# EAGLE design mosfet (EAGLE 8.5.1)
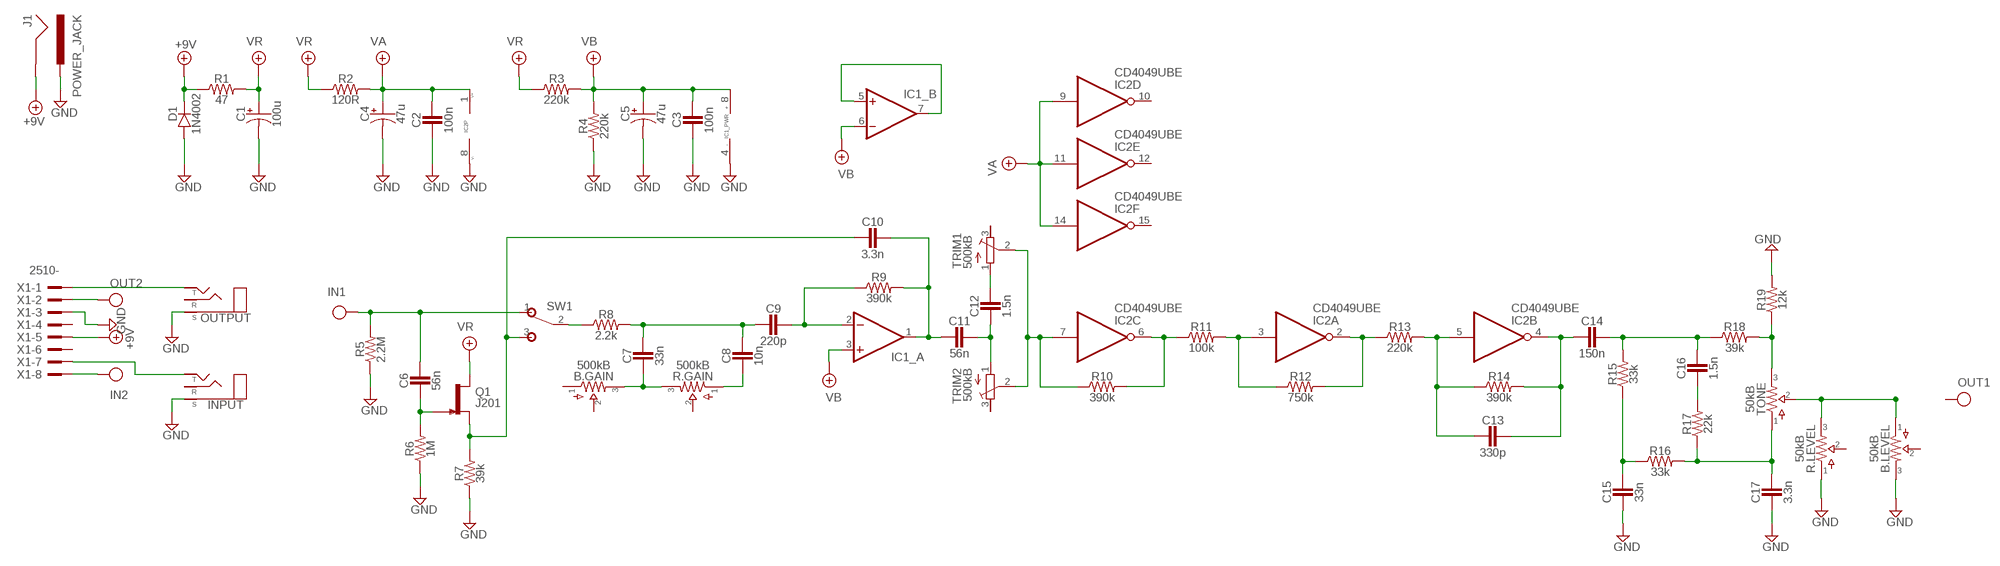
[diagram p0: schematic, sheet 1]

## Parts
B.GAIN  500kB  POTS16MM  [16MM]
B.LEVEL  50kB  POTS16MM  [16MM]
C1  100u  0500  [050_020]
C2  100n  CER/FILM2  [050X030_025_2]
C3  100n  CER/FILM2  [050X030_025_2]
C4  47u  0500  [050_020]
C5  47u  0500  [050_020]
C6  56n  CER/FILMBOX.1  [BOX_SMALL]
C7  33n  CER/FILMBOX.1  [BOX_SMALL]
C8  10n  CER/FILMBOX.1  [BOX_SMALL]
C9  220p  CER/FILM2  [050X030_025_2]
C10  3.3n  CER/FILM2  [050X030_025_2]
C11  56n  CER/FILM2  [050X030_025_2]
C12  1.5n  CER/FILM2  [050X030_025_2]
C13  330p  CER/FILM2  [050X030_025_2]
C14  150n  CER/FILM2  [050X030_025_2]
C15  33n  CER/FILM2  [050X030_025_2]
C16  1.5n  CER/FILM2  [050X030_025_2]
C17  3.3n  CER/FILM2  [050X030_025_2]
D1  1N4002  DO41.2  [DO41-2]
IC1  DUALTH  [DIL0]
IC2  CD4049UBE  [DIL16]
INPUT  STEREONMJ  [NMJ6HCD2]
J1  POWER_JACK  [POWER_JACK_PTH]
OUTPUT  STEREONMJ  [NMJ6HCD2]
Q1  J201  [TO92-]
R1  47  R_.3B  [R0207/3]
R2  120R  R_.3B  [R0207/3]
R3  220k  R_.3B  [R0207/3]
R4  220k  R_.3B  [R0207/3]
R5  2.2M  R_.3B  [R0207/3]
R6  1M  R_.3B  [R0207/3]
R7  39k  R_.3B  [R0207/3]
R8  2.2k  R_.3B  [R0207/3]
R9  390k  R_.3B  [R0207/3]
R10  390k  R_.3B  [R0207/3]
R11  100k  R_.3B  [R0207/3]
R12  750k  R_.3B  [R0207/3]
R13  220k  R_.3B  [R0207/3]
R14  390k  R_.3B  [R0207/3]
R15  33k  R_.3B  [R0207/3]
R16  33k  R_.3B  [R0207/3]
R17  22k  R_.3B  [R0207/3]
R18  39k  R_.3B  [R0207/3]
R19  12k  R_.3B  [R0207/3]
R.GAIN  500kB  POTS16MM  [16MM]
R.LEVEL  50kB  POTS16MM  [16MM]
SW1  SPDT  [M9040P]
TONE  50kB  POTS16MM  [16MM]
TRIM1  500kB  R-TRIMM3296W  [RTRIM3296W]
TRIM2  500kB  R-TRIMM3296W  [RTRIM3296W]
X1  2510-  [PAK100/2500-10]

## Nets
+9V: D1.C J1.GND R1.1 X1.5
GND: B.LEVEL.3 C1.- C2.1 C3.1 C4.- C5.- C15.1 C17.1 D1.A IC1.4(_PWR:V-) IC2.8(P:VSS) INPUT.S J1.PWR OUTPUT.S R4.1 R5.1 R6.1 R7.1 R19.2 R.LEVEL.1 X1.3
IN: C6.2 R5.2 SW1.1(O) X1.8
N$1: INPUT.T X1.7
N$2: C6.1 Q1.1(G) R6.2
N$3: C10.1 Q1.2(S) R7.2 SW1.3(S)
N$4: OUTPUT.T X1.1
N$5: R8.1 SW1.2(P)
N$6: C7.2 C8.2 C9.1 R8.2
N$7: B.GAIN.3 C7.1 R.GAIN.3
N$8: C8.1 R.GAIN.1
N$9: C9.2 IC1.2(_A:-IN) R9.1
N$10: C10.2 C11.1 IC1.1(_A:OUT) R9.2
N$11: C11.2 C12.1 TRIM2.1(A)
N$12: C12.2 TRIM1.1(A)
N$13: IC2.7(C:I) R10.1 TRIM1.2(S) TRIM2.2(S)
N$14: IC2.6(C:O) R10.2 R11.1
N$15: IC2.3(A:I) R11.2 R12.1
N$16: IC2.2(A:O) R12.2 R13.1
N$17: C13.1 IC2.5(B:I) R13.2 R14.1
N$18: C13.2 C14.1 IC2.4(B:O) R14.2
N$20: C14.2 C16.2 R15.2 R18.1
N$21: R18.2 R19.1 TONE.3
N$22: C16.1 R17.2
N$23: C17.2 R16.2 R17.1 TONE.1
N$24: C15.2 R15.1 R16.1
N$25: B.LEVEL.1 R.LEVEL.3 TONE.2
N$26: IC1.5(_B:+IN) IC1.7(_B:OUT)
OUT: X1.2
VA: C2.2 C4.+ IC2.1(P:VDD) IC2.9(D:I) IC2.11(E:I) IC2.14(F:I) R2.2
VB: C3.2 C5.+ IC1.3(_A:+IN) IC1.6(_B:-IN) IC1.8(_PWR:V+) R3.2 R4.2
VR: C1.+ Q1.3(D) R1.2 R2.1 R3.1
Unconnected: B.GAIN.1 B.GAIN.2 B.LEVEL.2 IC2.10(D:O) IC2.12(E:O) IC2.15(F:O) INPUT.R OUTPUT.R R.GAIN.2 R.LEVEL.2 TRIM1.3(E) TRIM2.3(E) X1.4 X1.6

## Library data of the parts
B.GAIN B.LEVEL R.GAIN R.LEVEL TONE = pedals-potentiometers:POTS
C1 C4 C5 = pedals-capacitors-elec:050
C2 C3 C6-C17 = pedals-capacitors-film:CER/FILM: 47 - 120pF Xicon Ceramic Disc 2.5mm lead spacing
D1 = pedals-diodes:DO41: DO-41 Package Diodes: 1N4001 - 1N40019 Zener Diodes: 1N4728 - 1N4764
IC1 = pedals-integrated circuits:DUAL: OP AMP
IC2 = pedals-integrated circuits:CD4049UBE: Hex Inverting Buffer Used, for example, in the Red Llama, Three Legged Dog, and Hot Harmonics.
INPUT OUTPUT = pedals-jacks:STEREO
J1 = pedals-jacks:POWER_JACK: Power Jack Connector This is the standard 5.5mm barrel jack for power. The PTH is the most common, proven, reliable, footprint. The Slot footprint only works if the mill layer is transmitted to the PCB fab house so be warned. Here are the connectors we sell at SparkFun: DC Barrel Power Jack/Connector <https://www.sparkfun.com/products/119> (PRT-00119) DC Barrel Power Jack/Connector (SMD) <https://www.sparkfun.com/products/12748> (PRT-12748) DC Barrel Jack Adapter - Breadboard Compatible <https://www.sparkfun.com/products/10811> (PRT-10811) It is used on this SparkFun product (and many, many others): SparkFun RedBoard - Programmed with Arduino <https://www.sparkfun.com/products/12757> (DEV-12757) Also, if you need a mating power supply or connector, please check these out: Wall Adapter Power Supply - 9VDC 650mA <https://www.sparkfun.com/products/298> (TOL-00298) DC Barrel Jack Adapter - Male <https://www.sparkfun.com/products/10287> (PRT-10287); PROD_ID: CONN-08197
Q1 = pedals-transistors:J201: N-channel JFET
R1-R19 = pedals-resistors:R_
SW1 = pedals-switches:SPDT: TOGGLE SWITCH Marquardt
TRIM1 TRIM2 = pedals-potentiometers:R-TRIMM: Trimm resistor
X1 = pedals-headers:2510-: 3M (TM) Pak 100 4-Wall Header Source: 3M; MF: 3M; MPN: 2510-6002UB; OC_FARNELL: 9838244; OC_NEWARK: 46F4725

## Board
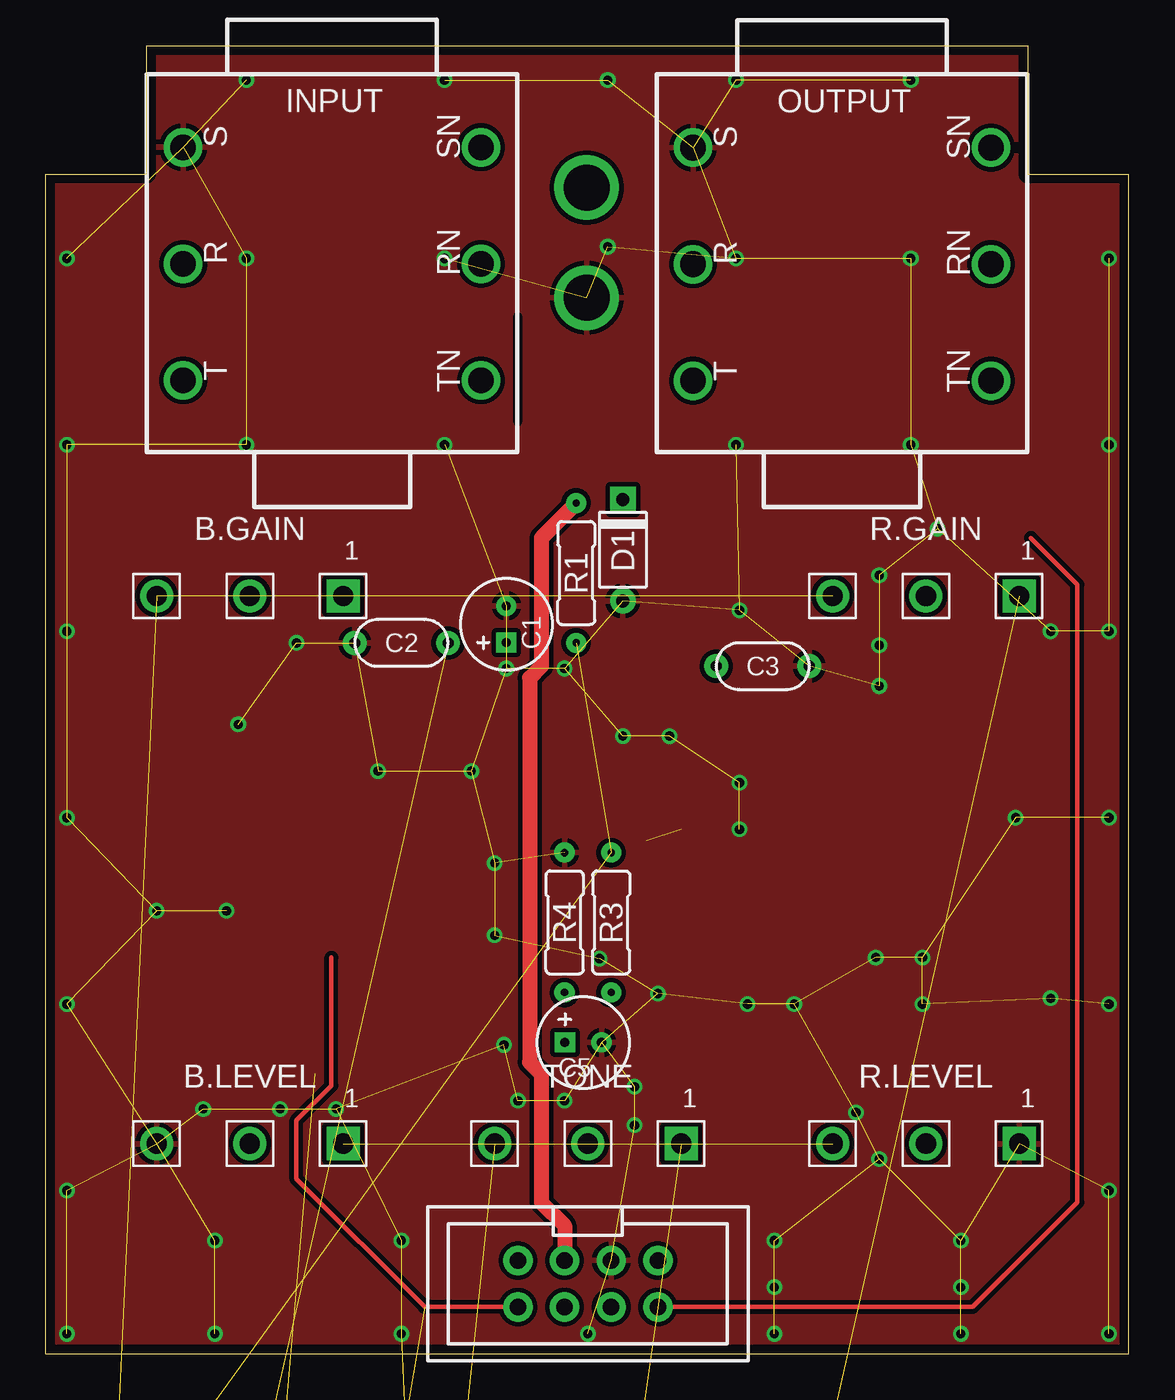
[diagram p1: board, top side]
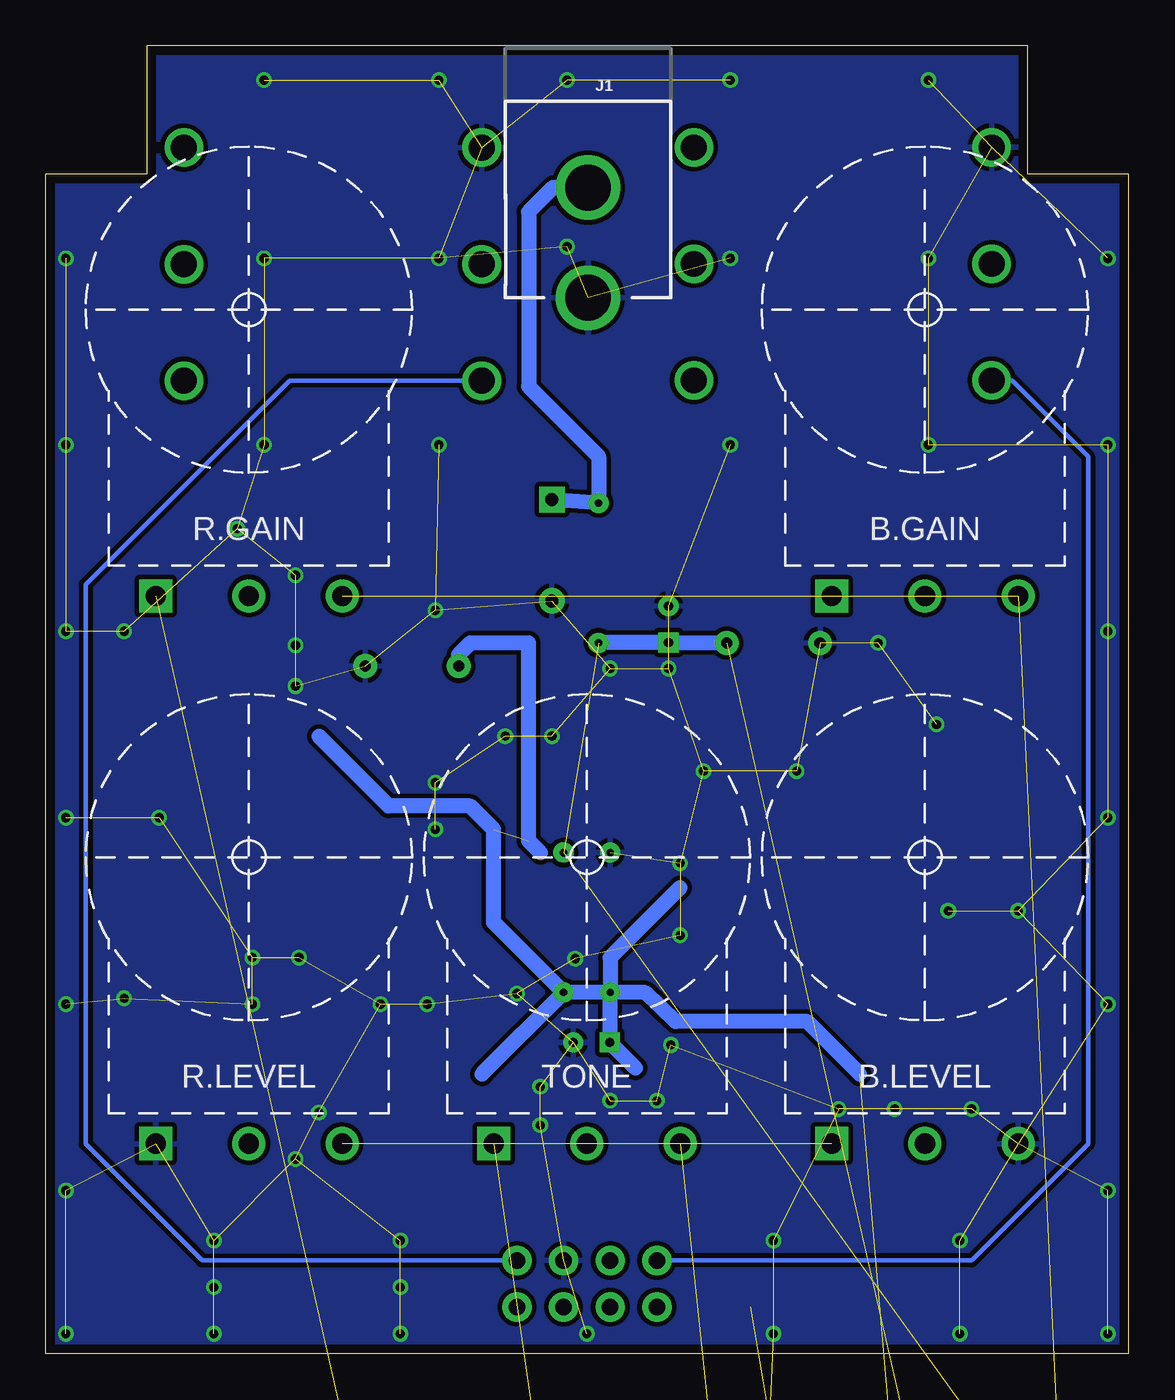
[diagram p2: board, bottom side, seen from below]

Size 59 x 71.27 mm. Coordinates in mm from the lower left corner, seen from the top.
Copper layers (1*16): Top 0.035mm / dielectric 1.6mm / Bottom 0.035mm
Design rules "Elecrow_2-layer_PCB_eagle_rule": minimum track width 6mil, minimum drill 12mil, track to track 6mil, track to pad 6mil, pad to pad 6mil, via to via 8mil, smd to smd 0mil, copper to edge 20mil, drill to drill 10mil, minimum pad ring 6mil, minimum via ring 6mil, stop-mask expansion 0mil, vias tented up to drill 100mil, thermal gap 10mil
tRestrict: 1 lines

### Footprints (pad centres in the part's own frame; a part is rotated, then mirrored left to right if it is on the bottom)
16MM = drill 1.1 pad 1.8 square: 1 5.08,-1 | drill 1.1 pad 1.8: 2 0,-1; 3 -5.08,-1
050_020 = drill 0.5 pad 1.1 square: + -0.998,0.001 | drill 0.5 pad 1.1: - 0.998,0.001
050X030_025_2 = drill 0.6 pad 1.3: 1 -2.54,0; 2 2.54,0
BOX_SMALL = drill 0.6 pad 1.3: 1 -2.54,0; 2 2.54,0
DO41-2 = drill 0.7 pad 1.4: A 2.794,0 | drill 0.7 pad 1.4 square: C -2.731,0
DIL0 = drill 0.813 pad 1.27: 1 -3.81,-3.81; 2 -1.27,-3.81; 3 1.27,-3.81; 4 3.81,-3.81; 5 3.81,3.81; 6 1.27,3.81; 7 -1.27,3.81; 8 -3.81,3.81
DIL16 = drill 0.813 pad 1.27: 1 -8.89,-3.81; 2 -6.35,-3.81; 3 -3.81,-3.81; 4 -1.27,-3.81; 5 1.27,-3.81; 6 3.81,-3.81; 7 6.35,-3.81; 8 8.89,-3.81; 9 8.89,3.81; 10 6.35,3.81; 11 3.81,3.81; 12 1.27,3.81; 13 -1.27,3.81; 14 -3.81,3.81; 15 -6.35,3.81; 16 -8.89,3.81
NMJ6HCD2 = drill 1.4: R 0,8.115; RN 0,-8.115; S 6.35,8.115; SN 6.35,-8.115; T -6.35,8.115; TN -6.35,-8.115
POWER_JACK_PTH = drill 2.5: GND 0,7.7; PWR 0,13.7
TO92- = drill 0.5 pad 1.2: 1 2.54,0; 2 0,0; 3 -2.54,0
R0207/3 = drill 0.4 pad 1.1: 1 -3.81,0; 2 3.81,0
M9040P = drill 2.2 pad 2.9 square: 1 4.636,0 | drill 2.2 pad 2.9: 2 0,0; 3 -4.61,0
RTRIM3296W = drill 0.5 pad 1.2 square: 1 0,-2.54 | drill 0.5 pad 1.2: 2 0,0; 3 0,2.54
PAK100/2500-10 = drill 0.9 pad 1.6: 1 -3.81,-1.27; 2 -3.81,1.27; 3 -1.27,-1.27; 4 -1.27,1.27; 5 1.27,-1.27; 6 1.27,1.27; 7 3.81,-1.27; 8 3.81,1.27

### Placement (x,y rotation side)
B.GAIN  11.11,42.29 0 top
B.LEVEL  11.11,12.45 0 top
C1  25.08,39.75 90 top
C2  19.37,38.74 0 top
C3  39.05,37.47 180 top
C4  -1.32,-75.56 0 top  (outside the outline)
C5  29.27,16.95 0 top
C6  -2.86,-111.76 0 top  (outside the outline)
C7  -2.86,-203.2 0 top  (outside the outline)
C8  -2.86,-216.53 0 top  (outside the outline)
C9  -2.86,-229.87 0 top  (outside the outline)
C10  -2.86,-254 0 top  (outside the outline)
C11  -2.86,-267.34 0 top  (outside the outline)
C12  -2.86,-280.67 0 top  (outside the outline)
C13  -26.99,-350.52 0 top  (outside the outline)
C14  -26.99,-363.86 0 top  (outside the outline)
C15  -26.99,-399.42 0 top  (outside the outline)
C16  -26.99,-412.75 0 top  (outside the outline)
C17  -26.99,-459.74 0 top  (outside the outline)
D1  31.43,43.82 270 top
IC1  7.3,-59.05 0 top  (outside the outline)
IC2  12.38,-38.73 0 top  (outside the outline)
INPUT  15.59,59.39 90 top
J1  29.46,71.25 180 bottom
OUTPUT  43.37,59.37 90 top
Q1  -2.86,-135.89 0 top  (outside the outline)
R1  28.89,42.55 270 top
R2  6.67,-11.43 0 top  (outside the outline)
R3  30.8,23.5 270 top
R4  28.26,23.5 270 top
R5  1.59,-87 0 top  (outside the outline)
R6  -2.22,-123.83 0 top  (outside the outline)
R7  -2.22,-147.95 0 top  (outside the outline)
R8  -2.22,-191.13 0 top  (outside the outline)
R9  -2.22,-241.94 0 top  (outside the outline)
R10  -26.35,-292.74 0 top  (outside the outline)
R11  -26.35,-304.17 0 top  (outside the outline)
R12  -26.35,-315.6 0 top  (outside the outline)
R13  -26.35,-327.03 0 top  (outside the outline)
R14  -26.35,-338.46 0 top  (outside the outline)
R15  -26.35,-375.92 0 top  (outside the outline)
R16  -26.35,-387.35 0 top  (outside the outline)
R17  -26.35,-424.81 0 top  (outside the outline)
R18  -26.35,-436.25 0 top  (outside the outline)
R19  -26.35,-447.68 0 top  (outside the outline)
R.GAIN  47.94,42.29 0 top
R.LEVEL  47.94,12.45 0 top
SW1  9.21,-169.54 0 top  (outside the outline)
TONE  29.53,12.45 0 top
TRIM1  -18.1,-278.13 0 top  (outside the outline)
TRIM2  -30.16,-278.13 0 top  (outside the outline)
U$1  [125B_PCB]  0,1.27 0 top
X1  29.53,3.81 180 top

### Tracks (layer width: path | path; a pad name or v marks a point on that pad's centre or on a via)
+9V
  Top 0.813: R1.1 26.99,44.45 26.99,37.47 26.35,36.83 26.35,15.88 26.99,15.24 26.99,8.26 28.26,6.98 X1.5
  Bottom 0.813: J1.GND 31.39,63.55 32.7,62.23 32.7,52.71 28.89,48.9 R1.1 D1.C
GND  (via drill 0.5 pad 0.85)  (98 unrouted)
  other vias: 57.91,59.69 57.91,49.53 10.92,69.41 21.72,69.41 30.61,69.41 1.14,49.53 10.92,59.69 10.92,49.53 21.72,59.69 21.72,49.53 30.61,60.33 37.59,69.41 47.12,69.41 37.59,59.69 37.59,49.53 47.12,59.69 47.12,49.53 57.91,39.37 57.91,29.21 57.91,19.05 57.91,8.89 57.91,1.08 49.85,1.08 39.69,1.08 29.53,1.08 19.37,1.08 9.21,1.08 1.14,1.08 1.14,59.69 1.14,39.37 1.14,29.21 1.14,19.05 1.14,8.89 19.37,6.16 39.69,3.62 49.85,3.62 54.74,19.37 52.83,29.21 54.74,39.37 45.4,10.6 44.13,13.14 28.26,13.78 25.72,13.78 32.07,12.45 32.07,14.54 33.34,19.62 30.16,21.53 24.45,22.8 24.96,16.83 15.81,13.33 12.76,13.33 9.21,6.16 39.69,6.16 49.85,6.16 8.57,13.33 6.03,24.13 9.84,24.13 10.48,34.29 18.1,31.75 13.65,38.74 47.75,19.05 47.75,21.59 45.21,21.59 40.77,19.05 38.23,19.05 37.78,28.57 37.78,31.11 31.43,33.66 33.97,33.66 45.4,36.39 45.4,38.61 48.58,44.96 45.4,42.42 37.78,40.51 25.08,37.34 28.26,37.34 23.18,31.75 24.45,26.73
  pour Top (isolate 0.254): 0.32,0 59.37,0 59.37,71.12 -0.32,71.12 -0.32,0
  pour Bottom (isolate 0.254): 0.32,71.12 59.37,71.12 58.74,-1.27 0.32,-1.27
IN  (3 unrouted)
  Top 0.254: X1.8 20.64,2.54 13.65,9.53 13.65,12.7 15.56,14.61 15.56,21.59
N$1
  Bottom 0.254: INPUT.T 6.37,53.04 2.22,48.9 2.22,11.43 8.57,5.08 X1.7
N$2  (2 unrouted)
N$3  (3 unrouted)
N$4
  Bottom 0.254: X1.1 50.48,5.08 56.83,11.43 56.83,41.91 45.72,53.02 OUTPUT.T
N$5  (1 unrouted)
N$6  (3 unrouted)
N$7  (2 unrouted)
N$8  (1 unrouted)
N$9  (2 unrouted)
N$10  (3 unrouted)
N$11  (2 unrouted)
N$12  (1 unrouted)
N$13  (3 unrouted)
N$14  (2 unrouted)
N$15  (2 unrouted)
N$16  (2 unrouted)
N$17  (3 unrouted)
N$18  (3 unrouted)
N$20  (3 unrouted)
N$21  (2 unrouted)
N$22  (1 unrouted)
N$23  (3 unrouted)
N$24  (2 unrouted)
N$25  (2 unrouted)
N$26  (1 unrouted)
OUT
  Top 0.254: X1.2 50.48,2.54 56.2,8.26 56.2,41.91 53.66,44.45
VA  (6 unrouted)
  Bottom 0.813: C2.2 25.07,38.74
VB  (4 unrouted)
  Bottom 0.813: 26.88,15.56 C5.+ 28.27,19.67 R4.2 | R4.2 R3.2 | 24.45,25.4 28.26,21.59 R4.2 | 14.67,15.24 17.53,18.1 24.7,18.1 26.35,19.68 R4.2 | 44.13,33.66 40.32,29.84 35.88,29.84 34.61,28.57 34.61,23.5 R3.2 | R3.2 35.24,15.24 | C3.2 36.51,38.1 35.88,38.74 32.7,38.74 32.7,27.94 32.07,27.3
VR  (3 unrouted)
  Bottom 0.813: C1.+ 28.88,38.75 R1.2